# Altium schematic sheet main.SchDoc
size A4; SheetNumber: 1; SheetTotal: 1
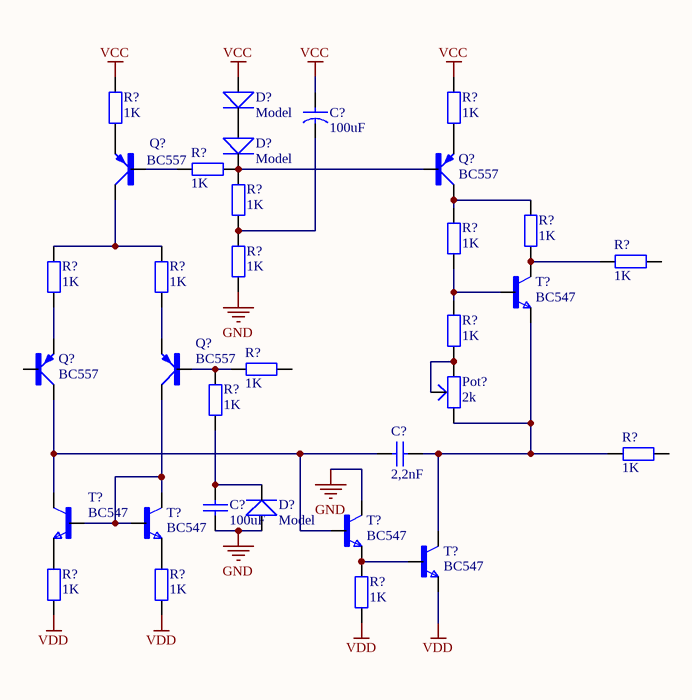
[diagram p0: main.SchDoc]

## Parts
(Parts that share a designator on the sheet are numbered #1, #2 ... from top to bottom, then left to right.)
C?#1  Capacity: 100uF  [Cap Lyt Ø8]  (hidden comment: Cap)
C?#2  Capacity: 2,2nF  [Cap-1]  (hidden comment: Cap)
C?#3  Capacity: 100uF  [Cap Ø8]  (hidden comment: Cap)
D?#1  Diode  [SMB]  (value not drawn)
D?#2  Diode  [SMB]  (value not drawn)
D?#3  Diode  [SMB]  (value not drawn)
Pot?  Resistance: 2k  [Pot Trim Long]  (hidden comment: Pot Trim)
Q?#1  BC557  [SOT54A]
Q?#2  BC557  [SOT54A]
Q?#3  BC557  [SOT54A]
Q?#4  BC557  [SOT54A]
R?#1  value 1K  [RES SMD 0201]  (hidden comment: Resistor)
R?#2  value 1K  [RES SMD 0201]  (hidden comment: Resistor)
R?#3  value 1K  [RES SMD 0201]  (hidden comment: Resistor)
R?#4  value 1K  [RES SMD 0201]  (hidden comment: Resistor)
R?#5  value 1K  [RES SMD 0201]  (hidden comment: Resistor)
R?#6  value 1K  [RES SMD 0201]  (hidden comment: Resistor)
R?#7  value 1K  [RES SMD 0201]  (hidden comment: Resistor)
R?#8  value 1K  [RES SMD 0201]  (hidden comment: Resistor)
R?#9  value 1K  [RES SMD 0201]  (hidden comment: Resistor)
R?#10  value 1K  [RES SMD 0201]  (hidden comment: Resistor)
R?#11  value 1K  [RES SMD 0201]  (hidden comment: Resistor)
R?#12  value 1K  [RES SMD 0201]  (hidden comment: Resistor)
R?#13  value 1K  [RES SMD 0201]  (hidden comment: Resistor)
R?#14  value 1K  [RES SMD 0201]  (hidden comment: Resistor)
R?#15  value 1K  [RES SMD 0201]  (hidden comment: Resistor)
R?#16  value 1K  [RES SMD 0201]  (hidden comment: Resistor)
R?#17  value 1K  [RES SMD 0201]  (hidden comment: Resistor)
T?#1  BC547  [TO92]
T?#2  BC547  [TO92]
T?#3  BC547  [TO92]
T?#4  BC547  [TO92]
T?#5  BC547  [TO92]

## Nets
GND: C?#3.1 D?#3.1 R?#7.2 T?#4.1(C)
VCC: C?#1.1 D?#1.1 R?#1.2 R?#2.2
VDD: R?#15.1 R?#16.1 R?#17.1 T?#5.3(E)
NetC?#1_2: C?#1.2(g) R?#4.2 R?#7.1
NetC?#2_1: C?#2.1 Q?#3.C T?#2.1(C) T?#4.2(B)
NetC?#2_2: C?#2.2(g) Pot?.2 R?#14.1 T?#1.3(E) T?#5.1(C)
NetC?#3_2: C?#3.2(g) D?#3.2 R?#12.2
NetD?#1_2: D?#1.2 D?#2.1
NetD?#2_2: D?#2.2 Q?#2.B R?#3.1 R?#4.1
NetPot?_1: Pot?.1 Pot?.3 R?#9.2
NetQ?#1_B: Q?#1.B R?#3.2
NetQ?#1_C: Q?#1.C R?#10.2 R?#11.2
NetQ?#1_E: Q?#1.E R?#1.1
NetQ?#2_C: Q?#2.C R?#5.1 R?#6.1
NetQ?#2_E: Q?#2.E R?#2.1
NetQ?#3_E: Q?#3.E R?#10.1
NetQ?#4_B: Q?#4.B R?#12.1 R?#13.1
NetQ?#4_C: Q?#4.C T?#2.2(B) T?#3.1(C) T?#3.2(B)
NetQ?#4_E: Q?#4.E R?#11.1
NetR?#5_2: R?#5.2 R?#8.1 T?#1.1(C)
NetR?#6_2: R?#6.2 R?#9.1 T?#1.2(B)
NetR?#15_2: R?#15.2 T?#2.3(E)
NetR?#16_2: R?#16.2 T?#3.3(E)
NetR?#17_2: R?#17.2 T?#4.3(E) T?#5.2(B)

Not connected (* = marked no-connect by the designer): Q?#3 B; R?#8 2; R?#13 2; R?#14 2

## Library data of the parts
C?#1 = Capacitor electrolytic
C?#2 = Capacitor 1 space
C?#3 = Capacitor unpolarized
Pot? = Pot Trim: Potentiometer
Q?#1-Q?#4 = BC557: Bipolar (BJT) Transistor PNP 45 V 100 mA 320MHz 625 mW Through Hole TO-92 (TO-226); MF: ON; Availability: In Stock; Package: E-PKG AXIAL-LEADED-2 ON Semiconductor; MP: BC557; Value: *; Check_prices: https://www.snapeda.com/parts/BC557/Onsemi/view-part/?ref=eda; SnapEDA_Link: https://www.snapeda.com/parts/BC557/Onsemi/view-part/?ref=snap; Price: None
T?#1-T?#5 = BC547: Trans GP BJT NPN 45V 0.1A 500mW 3-Pin TO-92 T/R; MF: ON Semiconductor; SnapEDA_Link: https://www.snapeda.com/parts/BC547/Onsemi/view-part/?ref=snap; Package: None; Value: *; MP: BC547; Check_prices: https://www.snapeda.com/parts/BC547/Onsemi/view-part/?ref=eda
D?#1-D?#3 = Diode: Model: Model